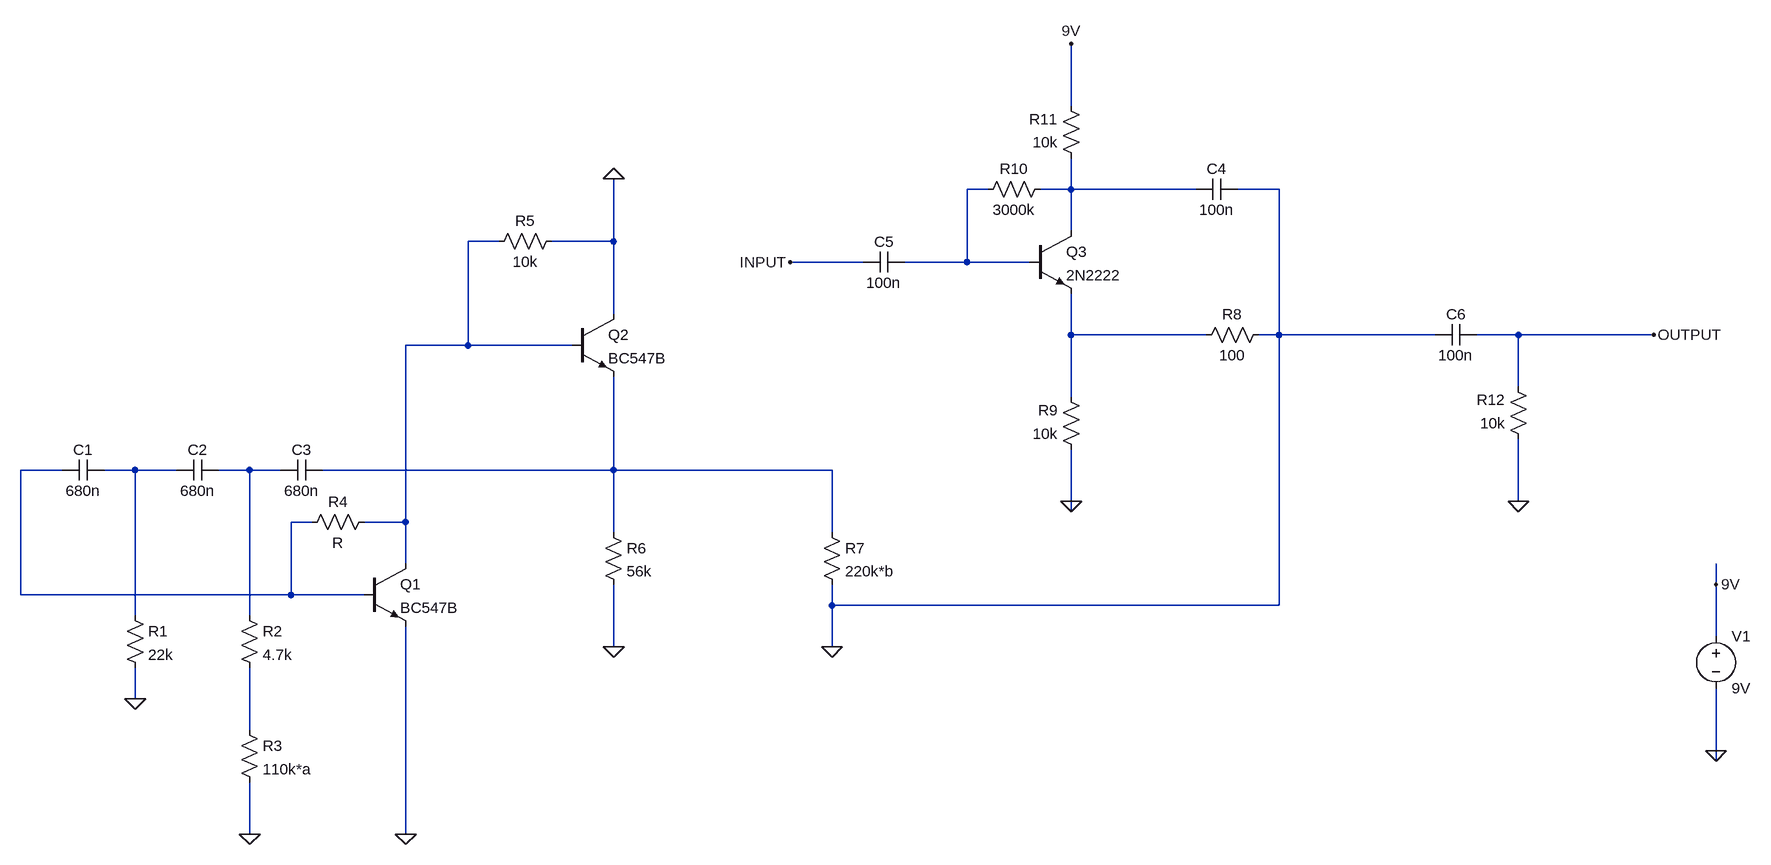
[diagram p0: schematic Vibrato.asc]
Vibrato.asc, the LTspice schematic file:
Version 4
SHEET 1 2388 804
WIRE 1328 -336 1328 -432
WIRE 1200 -208 1168 -208
WIRE 1328 -208 1328 -256
WIRE 1328 -208 1280 -208
WIRE 1520 -208 1328 -208
WIRE 1648 -208 1584 -208
WIRE 1328 -144 1328 -208
WIRE 448 -128 400 -128
WIRE 624 -128 624 -224
WIRE 624 -128 528 -128
WIRE 1008 -96 896 -96
WIRE 1168 -96 1168 -208
WIRE 1168 -96 1072 -96
WIRE 1264 -96 1168 -96
WIRE 624 -16 624 -128
WIRE 1328 16 1328 -48
WIRE 1536 16 1328 16
WIRE 1648 16 1648 -208
WIRE 1648 16 1616 16
WIRE 1888 16 1648 16
WIRE 2016 16 1952 16
WIRE 2224 16 2016 16
WIRE 400 32 400 -128
WIRE 400 32 304 32
WIRE 560 32 400 32
WIRE 2016 96 2016 16
WIRE 1328 112 1328 16
WIRE -224 224 -288 224
WIRE -112 224 -160 224
WIRE -48 224 -112 224
WIRE 64 224 16 224
WIRE 112 224 64 224
WIRE 624 224 624 80
WIRE 624 224 176 224
WIRE 960 224 624 224
WIRE 1328 272 1328 192
WIRE 2016 272 2016 176
WIRE 1328 288 1328 272
WIRE 160 304 128 304
WIRE 304 304 304 32
WIRE 304 304 240 304
WIRE 624 320 624 224
WIRE 960 320 960 224
WIRE 304 368 304 304
WIRE 2320 400 2320 368
WIRE -288 416 -288 224
WIRE 128 416 128 304
WIRE 128 416 -288 416
WIRE 240 416 128 416
WIRE 960 432 960 400
WIRE 1648 432 1648 16
WIRE 1648 432 960 432
WIRE -112 448 -112 224
WIRE 64 448 64 224
WIRE 2320 480 2320 400
WIRE 624 496 624 400
WIRE 960 496 960 432
WIRE -112 576 -112 528
WIRE 64 624 64 528
WIRE 2320 656 2320 560
WIRE 2320 672 2320 656
WIRE 64 784 64 704
WIRE 304 784 304 464
FLAG -112 576 0
FLAG 64 784 0
FLAG 624 -224 0
FLAG 304 784 0
FLAG 624 496 0
FLAG 960 496 0
FLAG 1328 -432 9V
FLAG 896 -96 INPUT
FLAG 2224 16 OUTPUT
FLAG 2016 272 0
FLAG 1328 272 0
FLAG 2320 656 0
FLAG 2320 400 9V
SYMBOL cap -160 208 R90
WINDOW 0 0 32 VBottom 2
WINDOW 3 32 32 VTop 2
SYMATTR InstName C1
SYMATTR Value 680n
SYMBOL cap 16 208 R90
WINDOW 0 0 32 VBottom 2
WINDOW 3 32 32 VTop 2
SYMATTR InstName C2
SYMATTR Value 680n
SYMBOL cap 176 208 R90
WINDOW 0 0 32 VBottom 2
WINDOW 3 32 32 VTop 2
SYMATTR InstName C3
SYMATTR Value 680n
SYMBOL res -128 432 R0
SYMATTR InstName R1
SYMATTR Value 22k
SYMBOL res 48 432 R0
SYMATTR InstName R2
SYMATTR Value 4.7k
SYMBOL res 48 608 R0
SYMATTR InstName R3
SYMATTR Value 110k*a
SYMBOL npn 240 368 R0
SYMATTR InstName Q1
SYMATTR Value BC547B
SYMBOL res 256 288 R90
WINDOW 0 0 56 VBottom 2
WINDOW 3 32 56 VTop 2
SYMATTR InstName R4
SYMBOL npn 560 -16 R0
SYMATTR InstName Q2
SYMATTR Value BC547B
SYMBOL res 544 -144 R90
WINDOW 0 0 56 VBottom 2
WINDOW 3 32 56 VTop 2
SYMATTR InstName R5
SYMATTR Value 10k
SYMBOL res 608 304 R0
SYMATTR InstName R6
SYMATTR Value 56k
SYMBOL res 944 304 R0
SYMATTR InstName R7
SYMATTR Value 220k*b
SYMBOL res 1632 0 R90
WINDOW 0 0 56 VBottom 2
WINDOW 3 32 56 VTop 2
SYMATTR InstName R8
SYMATTR Value 100
SYMBOL res 1344 208 R180
WINDOW 0 36 76 Left 2
WINDOW 3 36 40 Left 2
SYMATTR InstName R9
SYMATTR Value 10k
SYMBOL res 1184 -192 R270
WINDOW 0 32 56 VTop 2
WINDOW 3 0 56 VBottom 2
SYMATTR InstName R10
SYMATTR Value 3000k
SYMBOL npn 1264 -144 R0
SYMATTR InstName Q3
SYMATTR Value 2N2222
SYMBOL cap 1584 -224 R90
WINDOW 0 0 32 VBottom 2
WINDOW 3 32 32 VTop 2
SYMATTR InstName C4
SYMATTR Value 100n
SYMBOL cap 1072 -112 R90
WINDOW 0 0 32 VBottom 2
WINDOW 3 32 32 VTop 2
SYMATTR InstName C5
SYMATTR Value 100n
SYMBOL cap 1952 0 R90
WINDOW 0 0 32 VBottom 2
WINDOW 3 32 32 VTop 2
SYMATTR InstName C6
SYMATTR Value 100n
SYMBOL res 1344 -240 R180
WINDOW 0 36 76 Left 2
WINDOW 3 36 40 Left 2
SYMATTR InstName R11
SYMATTR Value 10k
SYMBOL res 2032 192 R180
WINDOW 0 36 76 Left 2
WINDOW 3 36 40 Left 2
SYMATTR InstName R12
SYMATTR Value 10k
SYMBOL voltage 2320 464 R0
SYMATTR InstName V1
SYMATTR Value 9V

The netlist it stands for:
* Vibrato.asc
C1 N006 N005 680n
C2 N007 N006 680n
C3 N008 N007 680n
R1 N006 0 22k
R2 N007 N009 4.7k
R3 N009 0 110k*a
Q1 N003 N005 0 0 BC547B
R4 N003 N005 R
Q2 0 N003 N008 0 BC547B
R5 0 N003 10k
R6 N008 0 56k
R7 N008 0 220k*b
R8 0 N004 100
R9 0 N004 10k
R10 N001 N002 3000k
Q3 N002 N001 N004 0 2N2222
C4 0 N002 100n
C5 N001 INPUT 100n
C6 OUTPUT 0 100n
R11 N002 9V 10k
R12 0 OUTPUT 10k
V1 9V 0 9V
.model NPN NPN
.model PNP PNP
.lib standard.bjt
.backanno
.end